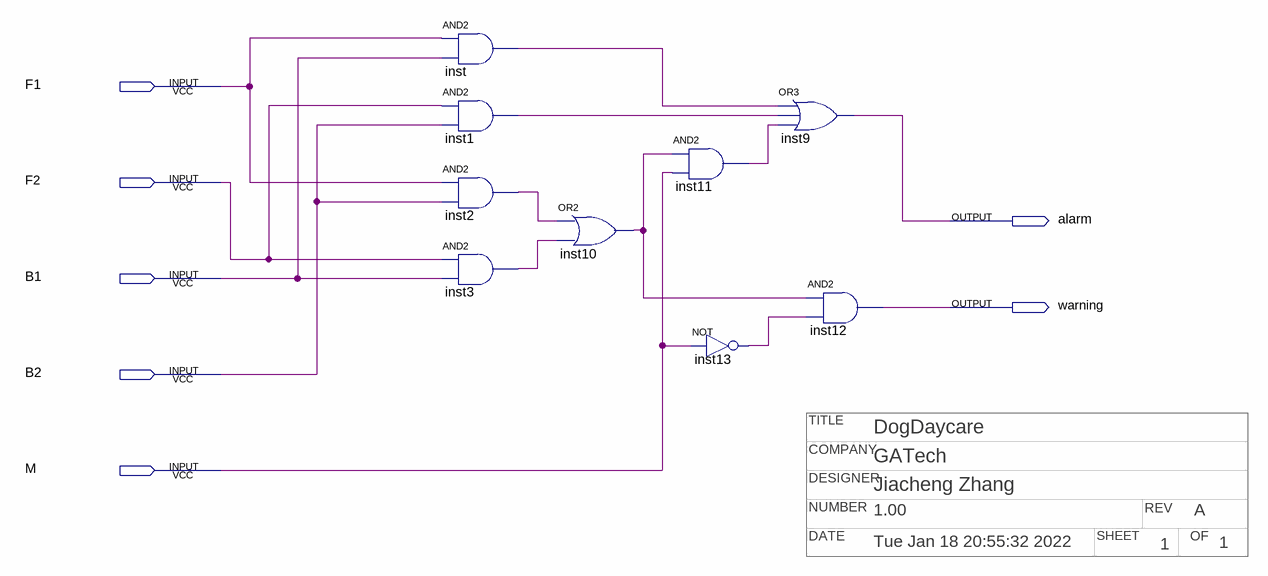
[diagram p0: schematic sheet]
// Quartus schematic DogDaycare.bdf as structural Verilog: 9 symbols, 7 pins
// Title block: COMPANY: GATech; DATE: Tue Jan 18 20:55:32 2022; DESIGNER: Jiacheng Zhang; NUMBER: 1.00; OF: 1; REV: A; SHEET: 1; TITLE: DogDaycare
module DogDaycare (
  input  F1,
  input  F2,
  input  B1,
  input  B2,
  input  M,
  output alarm,
  output warning
);

  wire inst1_out, inst2_out, inst3_out, inst10_out, inst11_out, inst13_out, inst_out;

  and inst (inst_out, F1, B1);
  and inst1 (inst1_out, F2, B2);
  and inst2 (inst2_out, F1, B2);
  and inst3 (inst3_out, F2, B1);
  or inst10 (inst10_out, inst2_out, inst3_out);
  and inst11 (inst11_out, inst10_out, M);
  not inst13 (inst13_out, M);
  or inst9 (alarm, inst_out, inst1_out, inst11_out);
  and inst12 (warning, inst10_out, inst13_out);
endmodule
